# Altium schematic sheet TRD.SchDoc
size A4; DocumentNumber: 10; SheetNumber: 10; SheetTotal: 10
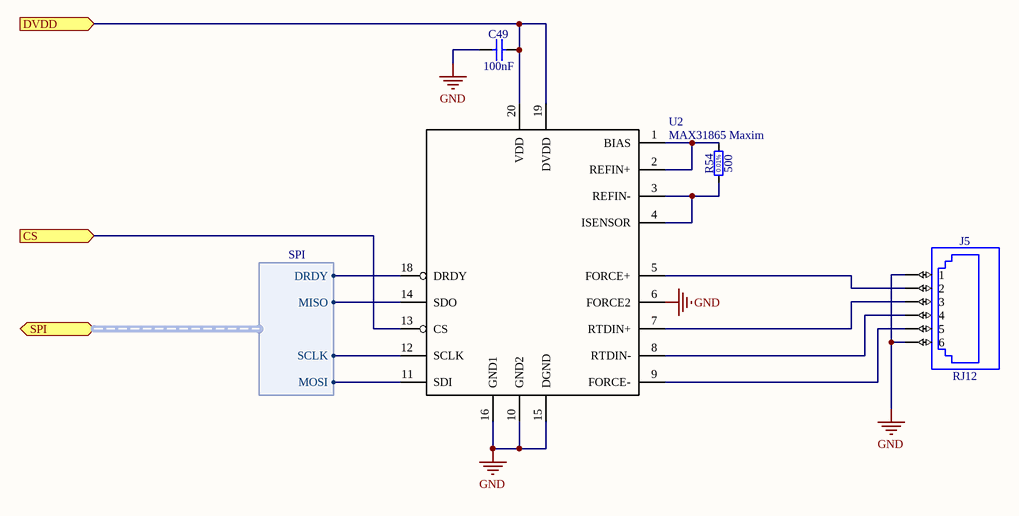
[diagram p0: TRD.SchDoc]

## Parts
C49  100nF  [CAPC2012X135N]
J5  RJ12  [WURTH_615006138521]
R54  500  [RESC2013X64N]
U2  MAX31865 Maxim  [QFN65P500X500X80-21N-S335]

## Ports
CS (in), DVDD (in), SPI (bidir, harness SPI)

## Harnesses
SPI: DRDY, MISO, SCLK, MOSI

## Nets
GND: C49.1 J5.1 J5.6 U2.6(FORCE2) U2.10(GND2) U2.15(DGND) U2.16(GND1)
CS: U2.13(CS) ; port CS
DVDD: C49.2 U2.19(DVDD) U2.20(VDD) ; port DVDD
NetJ5_2: J5.2 U2.5(FORCE+)
NetJ5_3: J5.3 U2.7(RTDIN+)
NetJ5_4: J5.4 U2.8(RTDIN-)
NetJ5_5: J5.5 U2.9(FORCE-)
NetR54_1: R54.1 U2.3(REFIN-) U2.4(ISENSOR)
NetR54_2: R54.2 U2.1(BIAS) U2.2(REFIN+)
NetU2_11: U2.11(SDI) ; port SPI.MOSI
NetU2_12: U2.12(SCLK) ; port SPI.SCLK
NetU2_14: U2.14(SDO) ; port SPI.MISO
NetU2_18: U2.18(DRDY) ; port SPI.DRDY

Not connected (* = marked no-connect by the designer): U2 17

## Notes on the sheet
- (in symbol R0805_500R_0.01%_0.2W_0.2PPM_VISHAY_VSMP) 0.01%

## Library data of the parts
C49 = CC0805_100NF_50V_10%_X7R: Non-polarised capacitor; Part Description: SMD Multilayer Chip Ceramic Capacitor; Manufacturer: GENERIC; Manufacturer1 Part Number: C2012X7R1H104K085AA; Voltage: 50V; TC: X7R; Tolerance: ±10%; Part Number: CC0805_100NF_50V_10%_X7R; Component Kind: Standard; Component Type: Standard; Pin Count: 2; Value: 100nF; Status: Preferred; Manufacturer Part Number: CC0805_100NF_50V_10%_X7R; Case: 0805; Mounted: Yes; Socket: No; SMD: Yes; Sense: No; Manufacturer1 Example: TDK; Manufacturer1 ComponentHeight: 1mm; HelpURL: \\cern.ch\dfs\Applications\Altium\Datasheets\CC0805_X7R_TDK_C.pdf; Author: CERN DEM JLC; CreateDate: 03.12.2007; LatestRevisionDate: 22.04.2015
J5 = WURTH_615006138521: Connector RJ12 (6P6C); Part Description: 1 Port RJ12 Connector, 6P6C,  Straight With Ears; Manufacturer: WURTH ELEKTRONIK; PressFit: No; Part Number: WURTH_615006138521; Component Kind: Standard; Component Type: Standard; Pin Count: 6; Family: RJ12; Mounted: Yes; Socket: No; SMD: No; Sense: No; Status: None; Manufacturer Part Number: 615006138521; ComponentHeight: 16.15mm; HelpURL: \\cern.ch\dfs\Applications\Altium\Datasheets\WURTH_615006138521.pdf; Author: CERN DEM MR; CreateDate: 15.03.2016; LatestRevisionDate: 15.03.2016
R54 = R0805_500R_0.01%_0.2W_0.2PPM_VISHAY_VSMP: Resistor - 0.01%; Part Description: Ultra High Precision Foil Wraparound Surface Mount Chip Resistor; Manufacturer: VISHAY PRECISION; Manufacturer Part Number: Y1624500R000T9R; Power: 0.2W; TC: ±0.2ppm/°C; PressFit: No; Part Number: R0805_500R_0.01%_0.2W_0.2PPM_VISHAY_VSMP; Component Kind: Standard; Component Type: Standard; Pin Count: 2; Value: 500; Status: None; Tolerance: ±0.01%; Case: 0805; Mounted: Yes; Sense: No; Socket: No; SMD: Yes; Manufacturer1 ComponentHeight: 0.64mm; HelpURL: \\cern.ch\dfs\Applications\Altium\Datasheets\R0805_VISHAY_VSMP.pdf; Author: CERN DEM JLC; CreateDate: 22.09.2011; LatestRevisionDate: 22.09.2011
U2 = MAX31865: Name: MAX31865; Manufacturer: Maxim